# EAGLE design calibratorSimple (EAGLE 9.6.2)
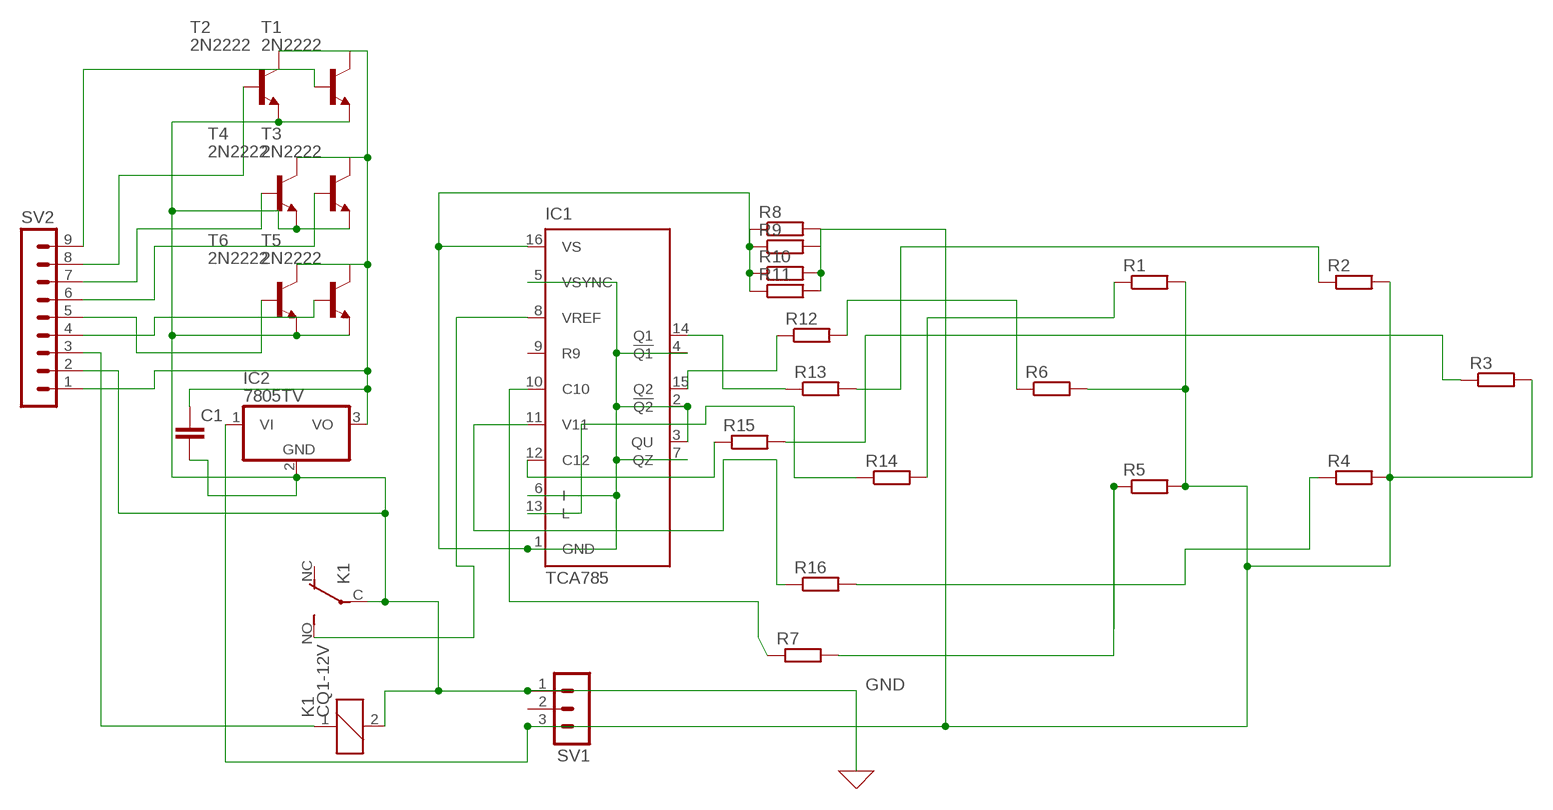
[diagram p0: schematic, sheet 1]

## Parts
C1  C2.5/2  [C2.5-2]
IC1  TCA785  [DIL16]
IC2  7805TV  [TO220V]
K1  CQ1-12V  [CQ1]
R1  R-EU_0207/15  [0207/15]
R2  R-EU_0207/15  [0207/15]
R3  R-EU_0207/15  [0207/15]
R4  R-EU_0207/15  [0207/15]
R5  R-EU_0207/15  [0207/15]
R6  R-EU_0207/15  [0207/15]
R7  R-EU_0204/7  [0204/7]
R8  R-EU_0204/7  [0204/7]
R9  R-EU_0204/7  [0204/7]
R10  R-EU_0204/7  [0204/7]
R11  R-EU_0204/7  [0204/7]
R12  R-EU_0204/7  [0204/7]
R13  R-EU_0204/7  [0204/7]
R14  R-EU_0204/7  [0204/7]
R15  R-EU_0204/7  [0204/7]
R16  R-EU_0204/7  [0204/7]
SV1  MA03-1  [MA03-1]
SV2  MA09-1  [MA09-1]
T1  2N2222  [TO18]
T2  2N2222  [TO18]
T3  2N2222  [TO18]
T4  2N2222  [TO18]
T5  2N2222  [TO18]
T6  2N2222  [TO18]

## Nets
GND: C1.2 IC2.2(GND) K1.2 K1.C(2:P) SV1.1 SV2.2 T1.1(E) T2.1(E) T3.1(E) T4.1(E) T5.1(E) T6.1(E)
N$1: IC1.11(V11) R16.1
N$2: IC2.1(VI) R1.2 R2.2 R3.2 R4.2 R5.2 R6.2 R8.2 R9.2 R10.2 R11.2 SV1.3
N$3: R1.1 R14.2
N$4: R4.1 R16.2
N$5: R3.1 R15.2
N$6: R6.1 R12.2
N$7: R5.1 R7.2
N$8: R2.1 R13.2
N$9: IC1.1(GND) IC1.2(!Q2) IC1.3(QU) IC1.4(!Q1) IC1.5(VSYNC) IC1.6(I) IC1.7(QZ) IC1.16(VS) R8.1 R9.1 R10.1 R11.1
N$10: IC1.15(Q2) R12.1
N$11: IC1.12(C12) R15.1
N$12: IC1.14(Q1) R13.1
N$13: IC1.13(L) R14.1
N$14: IC1.8(VREF) K1.NO(2:S)
N$15: IC1.10(C10) R7.1
N$16: SV2.4 T5.2(B)
N$18: C1.1 IC2.3(VO) SV2.1 T1.3(C) T2.3(C) T3.3(C) T4.3(C) T5.3(C) T6.3(C)
N$19: K1.1 SV2.3
N$21: SV2.5 T6.2(B)
N$22: SV2.6 T3.2(B)
N$23: SV2.7 T4.2(B)
N$24: SV2.8 T2.2(B)
N$25: SV2.9 T1.2(B)
Unconnected: IC1.9(R9) K1.NC(2:O) SV1.2

## Library data of the parts
C1 = capacitor-wima:C: CAPACITOR naming: grid - package width
IC1 = infineon:TCA785: Phase Control IC Source: http://www.infineon.com/ .. tca785.pdf; OC_FARNELL: unknown; OC_NEWARK: unknown
IC2 = linear:78*: Positive VOLTAGE REGULATOR Source: http://cache.national.com/ds/LM/LM78L05.pdf http://www.fairchildsemi.com/ds/LM/LM7805.pdf
K1 = relay:CQ1-12V: AUTOMOTIVE QUIET RELAY NAiS Source: http://www.mew-europe.com/.. en_ds_61208_0000.pdf; OC_FARNELL: unknown; OC_NEWARK: unknown
R1-R16 = rcl:R-EU_: RESISTOR, European symbol; SPICEPREFIX: R
SV1 = con-lstb:MA03-1: PIN HEADER; OC_FARNELL: unknown; OC_NEWARK: unknown
SV2 = con-lstb:MA09-1: PIN HEADER; OC_FARNELL: unknown; OC_NEWARK: unknown
T1-T6 = transistor:2N2222: NPN TRANSISTOR

## Board
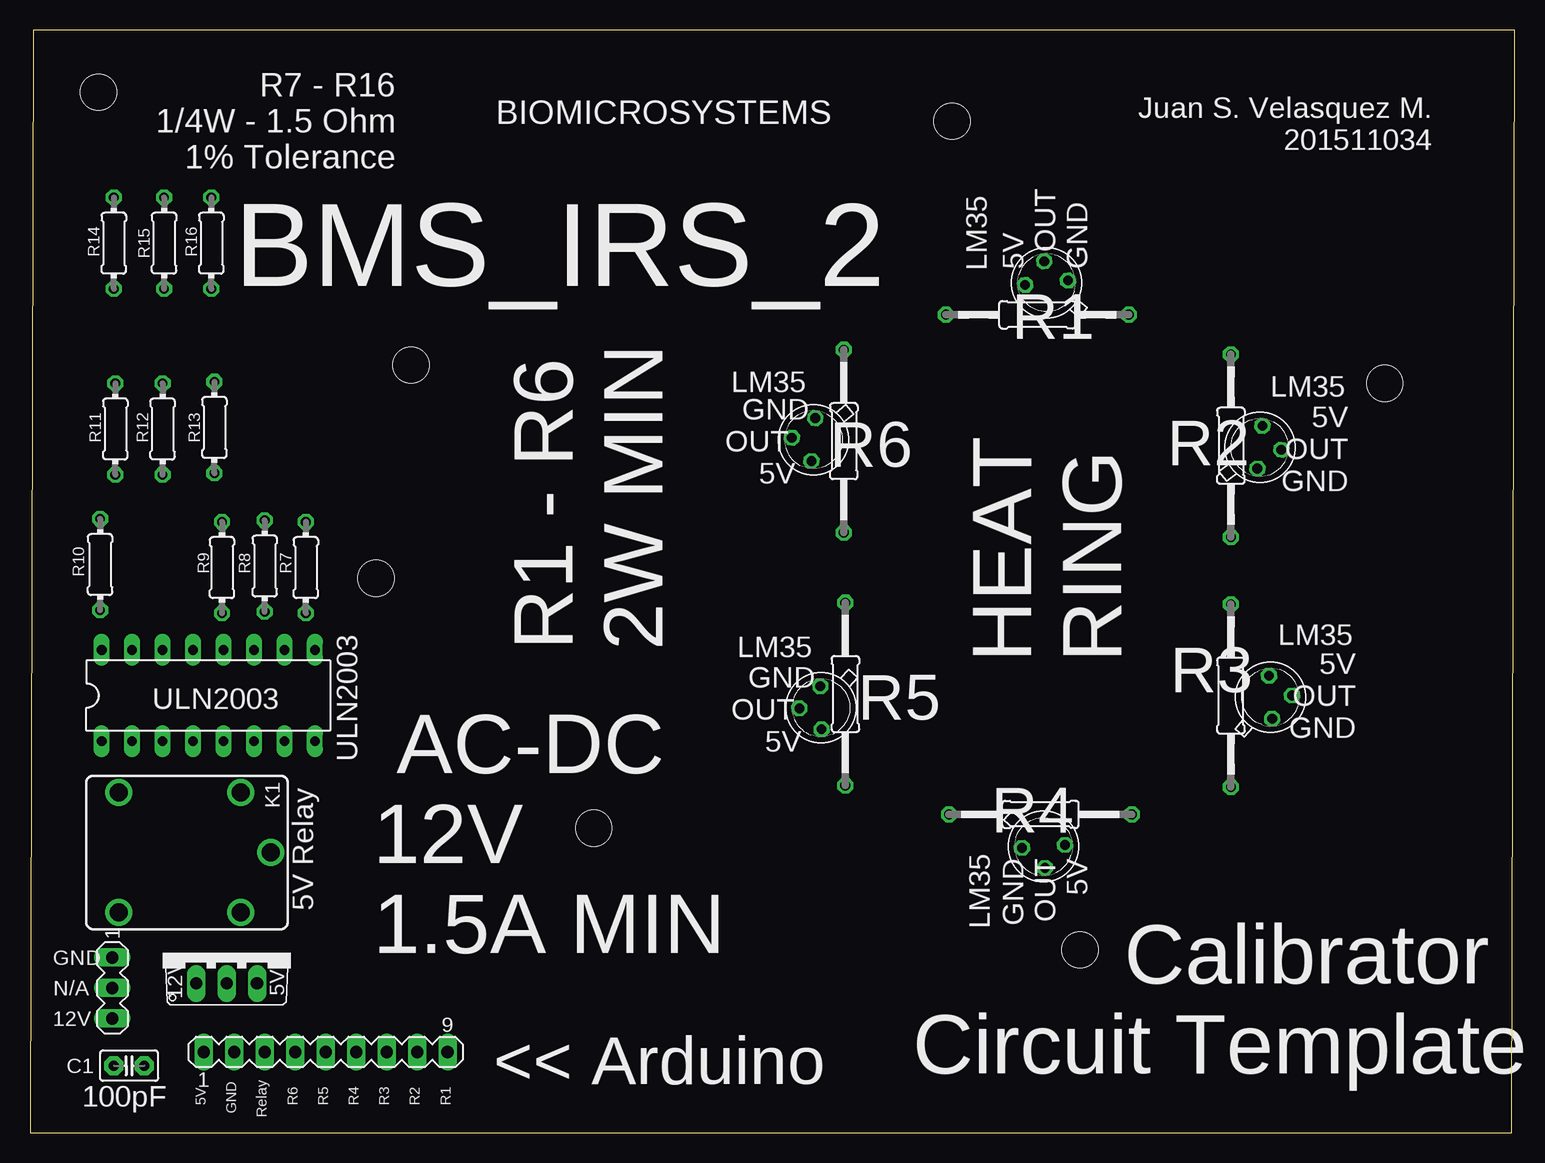
[diagram p1: board, top side]
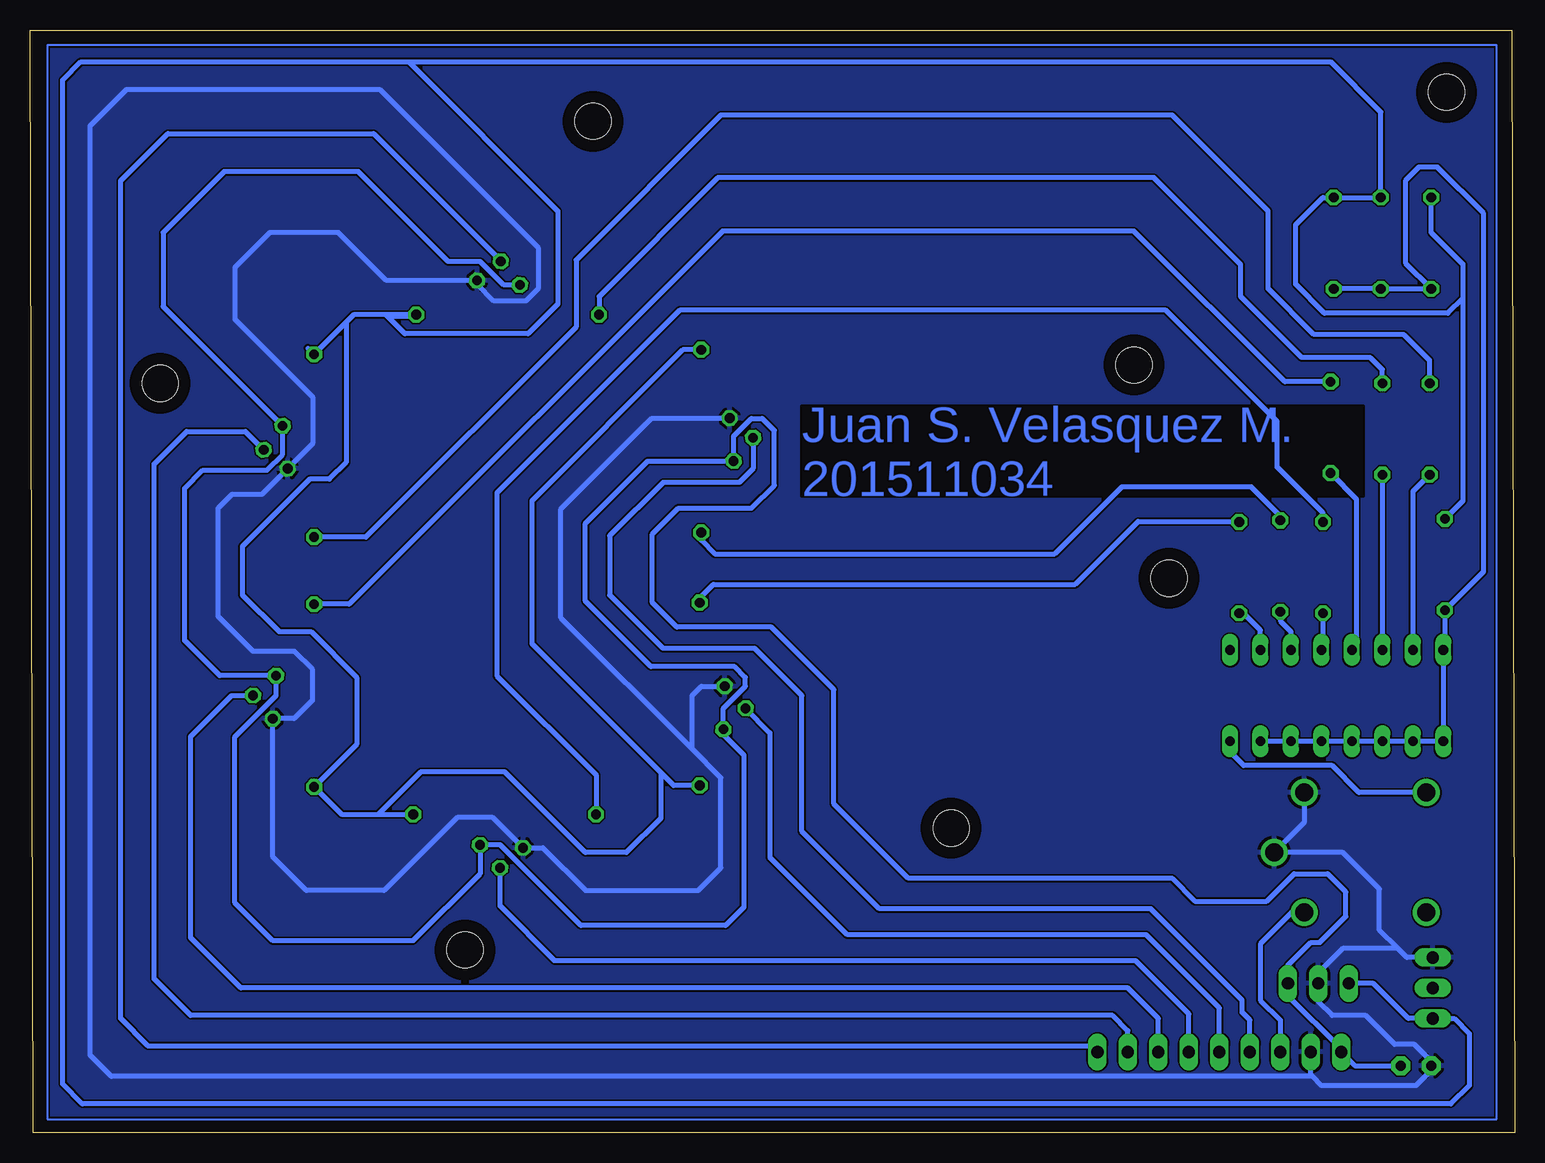
[diagram p2: board, bottom side, seen from below]

Size 123.75 x 91.94 mm. Coordinates in mm from the lower left corner, seen from the top.
Outline: 0,0 123.49,0 123.75,91.94 0.25,91.94 0,0
Copper layers (1*16): Top 0.035mm / dielectric 1.5mm / Bottom 0.035mm
Design rules "default": minimum track width 6mil, minimum drill 0.35mm, track to track 6mil, track to pad 6mil, pad to pad 6mil, via to via 6mil, smd to smd 6mil, copper to edge 40mil, drill to drill 6mil, minimum pad ring 10mil, minimum via ring 8mil, stop-mask expansion 4mil, vias tented up to drill 0mil, thermal gap 10mil
Holes 3 mm at 76.83,84.33 112.9,62.48 87.5,15.24 46.99,25.4 28.83,46.23 31.75,64.01 5.71,86.74

### Footprints (pad centres in the part's own frame; a part is rotated, then mirrored left to right if it is on the bottom)
C2.5-2 = drill 0.813 pad 1.6 octagon: 1 -1.27,0; 2 1.27,0
DIL16 = drill 0.813 long: 1 -8.89,-3.81; 2 -6.35,-3.81; 3 -3.81,-3.81; 4 -1.27,-3.81; 5 1.27,-3.81; 6 3.81,-3.81; 7 6.35,-3.81; 8 8.89,-3.81; 9 8.89,3.81; 10 6.35,3.81; 11 3.81,3.81; 12 1.27,3.81; 13 -1.27,3.81; 14 -3.81,3.81; 15 -6.35,3.81; 16 -8.89,3.81
TO220V = drill 1.016 long: 1 -2.54,-2.54; 2 0,-2.54; 3 2.54,-2.54
CQ1 = drill 1.5: 1 4.5,-5; 2 4.5,5; C 7,0; NC -5.7,-5; NO -5.7,5
0207/15 = drill 0.813 octagon: 1 -7.62,0; 2 7.62,0
0204/7 = drill 0.813 octagon: 1 -3.81,0; 2 3.81,0
MA03-1 = drill 1.016 long: 1 -2.54,0; 2 0,0; 3 2.54,0
MA09-1 = drill 1.016 long: 1 -10.16,0; 2 -7.62,0; 3 -5.08,0; 4 -2.54,0; 5 0,0; 6 2.54,0; 7 5.08,0; 8 7.62,0; 9 10.16,0
TO18 = drill 0.813 octagon: 1 -1.27,-1.27; 2 1.27,-1.27; 3 1.27,1.27

### Placement (x,y rotation side)
C1  8.26,5.59 180 top
IC1  14.86,36.45 0 top
IC2  16.38,14.99 0 top
K1  13.08,23.37 0 top
R1  100.08,36.45 270 top
R2  83.95,68.2 0 top
R3  84.2,26.54 0 top
R4  67.82,57.66 90 top
R5  67.94,36.58 270 top
R6  100.08,57.28 90 top
R7  22.99,47.12 90 top
R8  11.18,74.17 90 top
R9  5.84,47.37 90 top
R10  6.98,74.17 90 top
R11  15.11,74.17 90 top
R12  7.11,58.67 90 top
R13  11.05,58.67 90 top
R14  15.37,58.8 90 top
R15  16,47.12 90 top
R16  19.56,47.24 90 top
SV1  6.86,12.06 270 top
SV2  24.64,6.73 0 top
T1  84.71,70.87 141 top
T2  102.49,57.15 38.2 top
T3  84.45,23.88 319 top
T4  103.38,36.32 49.3 top
T5  65.28,57.78 219.8 top
T6  65.91,35.43 226.6 top

### Tracks (layer width: path | path; a pad name or v marks a point on that pad's centre or on a via)
GND
  Bottom 0.406: SV1.1 9.02,14.61 9.78,15.37 | 9.78,15.37 14.35,15.37 16.38,13.34 IC2.2 16.38,10.92 15.24,9.78 12.45,9.78 10.03,7.37 8.38,7.37 6.98,5.97 C1.2 6.98,5.21 8.26,3.94 16.13,3.94 16.89,4.7 | K1.2 17.58,25.87 K1.C 14.35,23.37 11.3,20.32 11.3,16.89 9.78,15.37 | 16.89,4.7 17.02,4.83 SV2.2 | 16.89,4.7 116.97,4.7 118.74,6.48 118.74,83.95 115.7,87 94.61,87 81.41,73.79 81.41,70.36 82.42,69.34 85.09,69.34 86.49,70.75 T1.1 94.04,71.05 98.04,75.06 103.76,75.06 106.68,72.14 106.68,67.82 100.2,61.34 100.2,57.44 T2.1 104.43,53.21 106.93,53.21 108.08,52.07 108.08,43.05 105.16,40.13 101.73,40.13 100.2,38.61 100.2,36.07 101.74,34.53 T4.1 103.51,22.99 100.71,20.19 94.23,20.19 88.14,26.29 85.2,26.29 T3.1 81.01,23.75 77.46,20.2 68.07,20.2 66.17,22.1 66.17,29.59 68.58,32 | 68.58,32 68.58,36.45 67.8,37.23 T6.1 | 68.58,32 79.5,42.93 79.5,51.99 71.92,59.57 T5.1
  pour Bottom: 0,92.46 123.57,92.46 123.57,-0.89 0,-0.89
N$1
  Bottom 0.406: R16.1 19.56,42.67 18.67,41.78 IC1.11
N$2
  Bottom 0.406: R9.2 4.32,52.7 4.32,69.6 | R10.2 6.98,75.06 4.32,72.39 4.32,69.6 | 4.32,69.6 5.59,68.33 15.88,68.33 18.29,70.74 18.29,75.69 16,77.98 R11.2 R8.2 11.18,85.09 15.37,89.28 92.2,89.28 | IC2.1 11.81,12.45 8.89,9.53 SV1.3 5.08,9.53 3.81,8.25 3.81,3.94 5.33,2.41 119.38,2.41 121.03,4.06 121.03,87.76 119.51,89.28 92.2,89.28 | 100.58,65.41 R6.2 97.41,67.56 | 92.2,89.28 79.76,76.84 79.76,69.09 82.23,66.61 92.52,66.61 93.98,68.07 91.69,68.07 R2.2 96.77,68.2 97.41,67.56 | 94.74,26.54 97.79,26.54 R1.2 96.52,32.38 96.52,37.97 100.33,41.78 103,41.78 106.05,44.83 106.05,48.89 100.46,54.48 98.81,54.48 97.41,55.88 97.41,67.56 | 94.74,26.54 R3.2 | 94.74,26.54 91.19,30.1 84.2,30.1 77.47,23.37 74.04,23.37 71.18,26.23 71.18,30.04 | R4.2 69.34,65.28 81.91,52.7 81.91,40.77 71.18,30.04 | R5.2 70.1,28.96 71.18,30.04
N$3
  Bottom 0.406: R14.2 19.18,62.61 31.75,75.18 66.04,75.18 97.16,44.07 R1.1
N$4
  Bottom 0.406: R4.1 67.82,49.4 66.67,48.26 38.35,48.26 32.77,53.85 21.97,53.85 19.56,51.43 R16.2
N$5
  Bottom 0.406: R3.1 76.58,29.84 84.84,38.1 84.84,53.34 69.6,68.58 29.08,68.58 19.81,59.31 19.81,55.5 16,51.69 R15.2
N$6
  Bottom 0.406: R12.2 7.11,64.39 9.27,66.55 16.76,66.55 20.57,70.36 20.57,76.84 28.57,84.84 66.17,84.84 78.23,72.77 78.23,67.18 95.76,49.66 R6.1
N$7
  Bottom 0.406: R5.1 67.94,44.58 66.8,45.72 36.66,45.72 31.41,50.97 23.03,50.97 R7.2
N$8
  Bottom 0.406: R2.1 76.33,69.72 66.42,79.63 30.1,79.63 22.86,72.39 22.86,69.72 17.78,64.64 12.06,64.64 11.05,63.63 R13.2
N$9
  Bottom 0.406: R11.1 R8.1 R10.1 9.14,72.52 9.14,79.38 8,80.52 6.48,80.52 2.62,76.66 2.62,46.79 R9.1 5.84,40.39 IC1.16 IC1.1 IC1.2 IC1.3 IC1.4 IC1.5 IC1.6 IC1.7
N$10
  Bottom 0.406: R12.1 8.51,53.47 IC1.15
N$11
  Bottom 0.406: R15.1 16,40.39 IC1.12
N$12
  Bottom 0.406: R13.1 IC1.14
N$13
  Bottom 0.406: R14.1 13.21,52.83 13.21,40.64 IC1.13
N$14
  Bottom 0.406: K1.NO 13,28.37 15.24,30.61 22.61,30.61 23.75,31.75 IC1.8
N$15
  Bottom 0.406: IC1.10 21.21,41.91 22.61,43.31 R7.1
N$16
  Bottom 0.406: SV2.4 22.1,9.4 22.73,10.03 22.73,11.05 30.35,18.67 52.96,18.67 59.44,25.15 59.44,36.45 63.37,40.39 70.99,40.39 75.44,44.83 75.44,49.78 70.99,54.23 64.64,54.23 63.49,55.38 T5.2
N$17
  Bottom 0.152: 1.52,90.68 122.3,90.68 122.3,1.14 1.52,1.14 1.52,90.68
N$18
  Bottom 0.406: C1.1 13.33,5.59 SV2.1 14.48,6.99 18.92,11.43 IC2.3 18.92,13.97 17.02,15.88 16.26,15.88 14.1,18.03 14.1,20.07 15.62,21.59 18.41,21.59 20.7,19.3 26.67,19.3 28.57,21.21 50.55,21.21 56.77,27.43 56.77,36.96 61.98,42.16 69.85,42.16 71.88,44.2 71.88,49.91 69.72,52.07 63.63,52.07 61.72,53.98 61.72,58.55 62.74,59.56 63.63,59.56 65.11,58.07 T5.3 72.27,56 77.47,50.8 77.47,44.32 72.01,38.86 65.02,38.86 64.14,37.97 64.14,37.21 65.96,35.38 T6.3 65.96,33.2 64.26,31.5 64.26,18.8 65.79,17.27 77.85,17.27 84.58,24 T3.3 86.25,21.59 91.83,16 103.5,16 106.68,19.18 106.68,33.02 103.24,36.46 T4.3 107.94,38.11 110.87,41.04 110.87,53.72 109.35,55.24 104.01,55.24 102.7,56.56 T2.3 112.65,68.88 112.65,75.06 107.57,80.14 96.39,80.14 88.9,72.64 86.23,72.64 84.27,70.68 T1.3
N$19
  Bottom 0.406: K1.1 18.59,18.37 21.21,15.75 21.21,11.05 19.56,9.4 SV2.3
N$21
  Bottom 0.406: SV2.5 24.64,10.41 30.73,16.51 55.63,16.51 62.09,22.97 62.09,33.35 T6.2
N$22
  Bottom 0.406: SV2.6 27.18,9.91 31.62,14.35 80.02,14.35 84.58,18.91 T3.2
N$23
  Bottom 0.406: SV2.7 29.72,9.53 32.26,12.06 106.17,12.06 110.36,16.26 110.36,33.04 106.95,36.46 T4.2
N$24
  Bottom 0.406: SV2.8 32.26,8.51 33.53,9.78 110.36,9.78 113.41,12.83 113.41,55.75 110.7,58.46 105.8,58.46 T2.2
N$25
  Bottom 0.406: SV2.9 35.31,7.24 113.92,7.24 116.2,9.53 116.2,79.38 112.27,83.31 95.12,83.31 84.52,72.71 T1.2

### Text on the board
Bottom: Juan S. Velasquez M. / 201511034
tPlace: R7 - R16 / 1/4W - 1.5 Ohm / 1% Tolerance | BIOMICROSYSTEMS | Juan S. Velasquez M. / 201511034 | BMS_IRS_2 | LM35 | 5V / OUT / GND | LM35 | LM35 | 5V / OUT / GND | GND / OUT / 5V | ULN2003 | LM35 | R1 - R6 / 2W MIN | LM35 | 5V / OUT / GND | HEAT / RING | ULN2003 | GND / OUT / 5V | GND / OUT / 5V | 5V Relay | LM35 | AC-DC / 12V / 1.5A MIN | GND | N/A | 12V | 5V | 12V | Calibrator / Circuit Template | << Arduino | 100pF | 5V / / GND / / Relay / / R6 / / R5 / / R4 / / R3 / / R2 / / R1